# EAGLE design power distribution board (EAGLE 8.4.0)
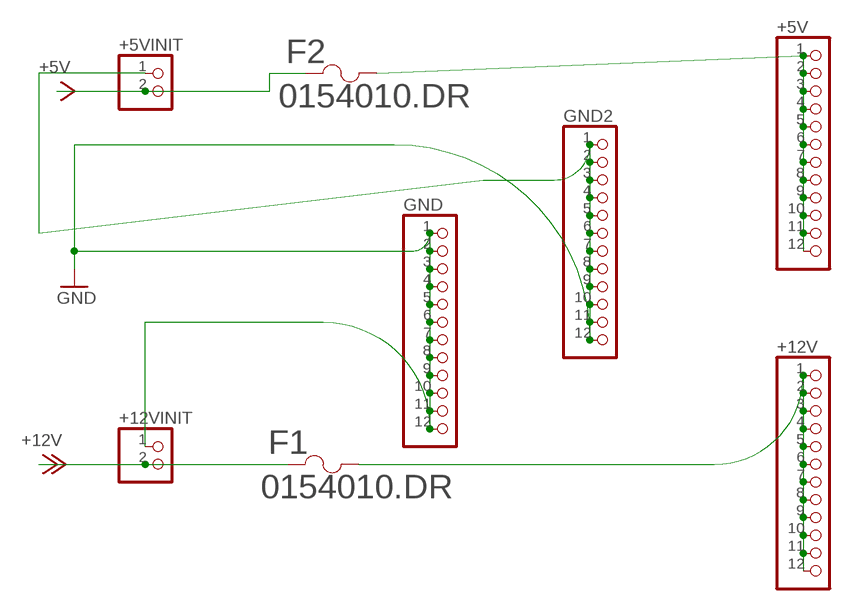
[diagram p0: schematic, sheet 1]

## Parts
+5V  TERM_BLOCK_12  [TERM_BLOCK_12]
+5VINIT  TERM_BLOCK_2TERM_BLOCK_2  [1X02]
+12V  TERM_BLOCK_12  [TERM_BLOCK_12]
+12VINIT  TERM_BLOCK_2TERM_BLOCK_2  [1X02]
F1  0154010.DR  [0154SERIES]
F2  0154010.DR  [0154SERIES]
GND  TERM_BLOCK_12  [TERM_BLOCK_12]
GND2  TERM_BLOCK_12  [TERM_BLOCK_12]

## Nets
+5V: +5VINIT.2 F2.1
+5VDIST: +5V.1 +5V.2 +5V.3 +5V.4 +5V.5 +5V.6 +5V.7 +5V.8 +5V.9 +5V.10 +5V.11 +5V.12 F2.2
+12V: +12VINIT.2 F1.1
+12VDIST: +12V.1 +12V.2 +12V.3 +12V.4 +12V.5 +12V.6 +12V.7 +12V.8 +12V.9 +12V.10 +12V.11 +12V.12 F1.2
GND: +5VINIT.1 +12VINIT.1 GND2.1 GND2.2 GND2.3 GND2.4 GND2.5 GND2.6 GND2.7 GND2.8 GND2.9 GND2.10 GND2.11 GND2.12 GND.1 GND.2 GND.3 GND.4 GND.5 GND.6 GND.7 GND.8 GND.9 GND.10 GND.11 GND.12

## Library data of the parts
+5V +12V GND GND2 = TERM_BLOCK_12:TERM_BLOCK_12: PIN HEADER
+5VINIT +12VINIT = Term_block:TERM_BLOCK_2: PIN HEADER
F1 F2 = Littlefuse Fuse:0154010.DR; MANUFACTURER_PART_NUMBER: 0154010.DR; VENDOR: Littelfuse Inc

## Board
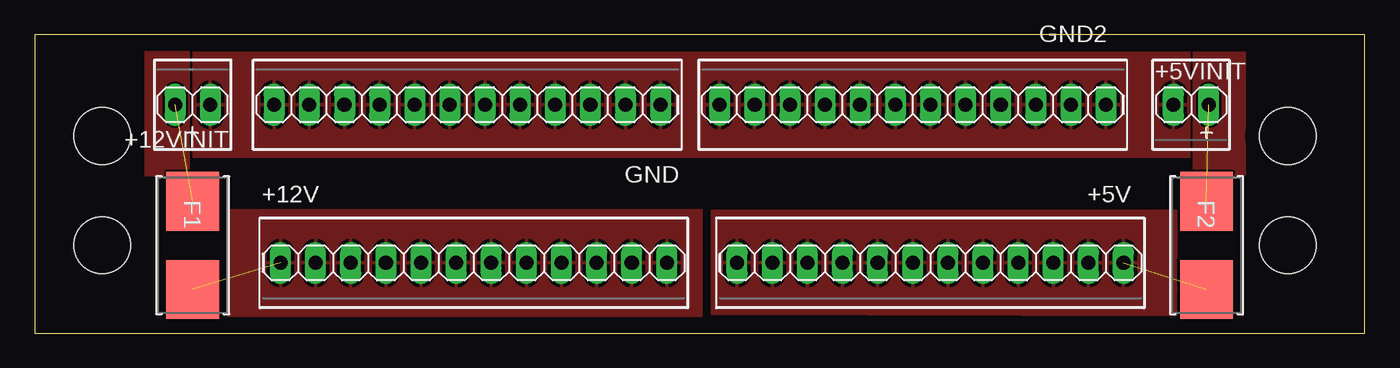
[diagram p1: board, top side]

Size 96.19 x 21.58 mm. Coordinates in mm from the lower left corner, seen from the top.
Outline: 0,0 96.19,0 96.19,21.58 0,21.58 0,0
Copper layers (1*16): Top 0.035mm / dielectric 1.5mm / Bottom 0.035mm
Design rules "default": minimum track width 6mil, minimum drill 0.35mm, track to track 6mil, track to pad 6mil, pad to pad 6mil, via to via 6mil, smd to smd 6mil, copper to edge 40mil, drill to drill 6mil, minimum pad ring 10mil, minimum via ring 8mil, stop-mask expansion 4mil, vias tented up to drill 0mil, thermal gap 10mil
Holes 4.1 mm at 4.89,14.25 90.62,14.25 4.89,6.35 90.62,6.35

### Footprints (pad centres in the part's own frame; a part is rotated, then mirrored left to right if it is on the bottom)
TERM_BLOCK_12 = drill 1.016 long: 1 -13.97,0; 2 -11.43,0; 3 -8.89,0; 4 -6.35,0; 5 -3.81,0; 6 -1.27,0; 7 1.27,0; 8 3.81,0; 9 6.35,0; 10 8.89,0; 11 11.43,0; 12 13.97,0
1X02 = drill 1.016 long: 1 -1.27,0; 2 1.27,0
0154SERIES = smd 4.242 x 3.81: 1 -3.188,0; 2 3.188,0

### Placement (x,y rotation side)
+5V  64.77,5.08 0 top
+5VINIT  83.62,16.51 0 top
+12V  31.75,5.08 0 top
+12VINIT  11.43,16.51 180 top
F1  11.43,6.35 270 top
F2  84.74,6.35 270 top
GND  31.29,16.51 180 top
GND2  63.5,16.51 180 top

### Tracks (layer width: path | path; a pad name or v marks a point on that pad's centre or on a via)
+5INIT
  pour Top: 83.82,20.32 87.49,20.32 87.49,11.43 83.82,11.43
+5V  (1 unrouted)
+5VDIST  (1 unrouted)
  pour Top: 48.99,8.89 82.55,8.89 82.55,1.27 48.99,1.35
+12V  (1 unrouted)
+12VDIST  (1 unrouted)
  pour Top: 13.97,8.89 13.97,1.27 48.26,1.27 48.26,8.89
+12VINIT
  pour Top: 7.99,20.32 7.99,11.43 11.18,11.43 11.18,20.32
GND
  pour Top: 11.49,20.32 83.51,20.32 83.51,12.7 11.49,12.7